# Altium schematic sheet leo_SBM_BUCK.SchDoc
size A; SheetNumber: 2; SheetTotal: 6
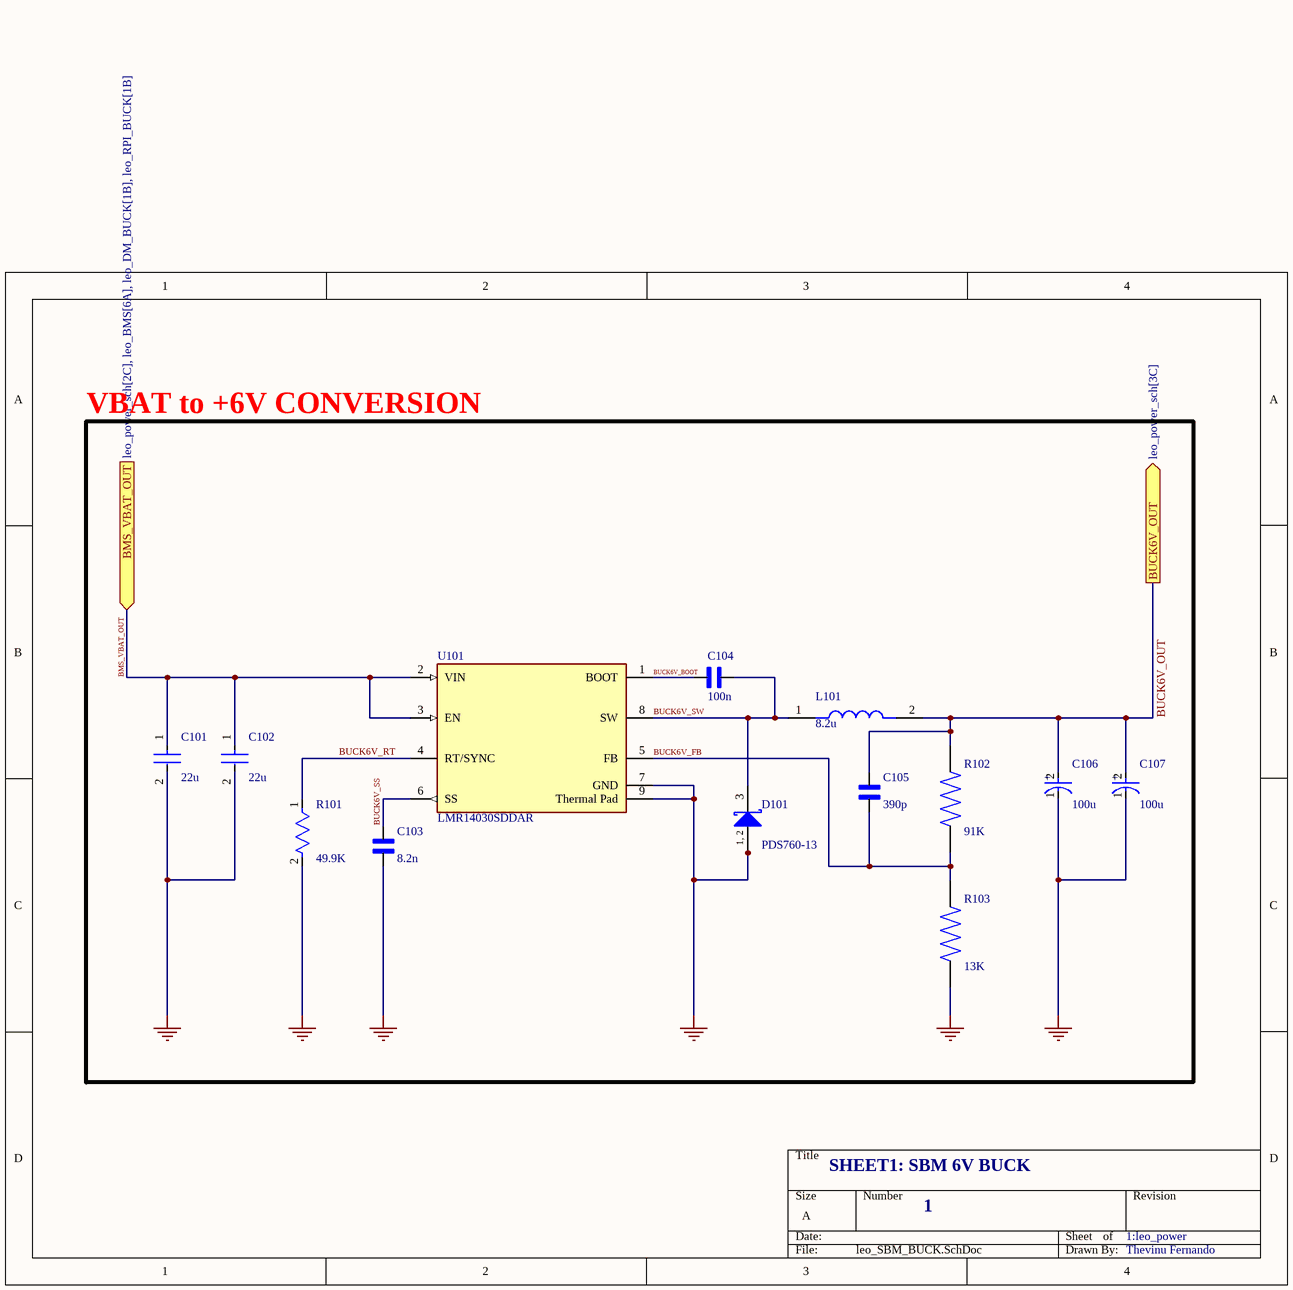
[diagram p0: leo_SBM_BUCK.SchDoc]

## Parts
C101  22u  [CAP_1206]
C102  22u  [CAP_1206]
C103  8.2n  [CAP_0402]
C104  100n  [CAP_0402]
C105  390p  [CAP_0402]
C106  100u  [FP-OS-CON-SMT-C6-MFG]
C107  100u  [FP-OS-CON-SMT-C6-MFG]
D101  PDS760-13  [DIOD-POWERDI5-3_V]
L101  8.2u  [IND_104CDMCCDS-8R2MC]
R101  49.9K  [RES_0805]
R102  91K  [RES_0603]
R103  13K  [RES_0603]
U101  LMR14030SDDAR  [FP-DDA0008E-MFG]

## Blocks framed on the sheet
VBAT to +6V CONVERSION: C101-C107 D101 L101 R101-R103 U101

## Ports
BMS_VBAT_OUT (in, see leo_power_sch[2C], leo_BMS[6A], leo_DM_BUCK[1B], leo_RPI_BUCK[1B]), BUCK6V_OUT (out, see leo_power_sch[3C])

## Nets
GND: C101.2 C102.2 C103.1 C106.1(C) C107.1(C) D101.1(A) D101.2(A) R101.2 R103.1 U101.7(GND) U101.9(Thermal_Pad)
BMS_VBAT_OUT: C101.1 C102.1 U101.2(VIN) U101.3(EN) ; port BMS_VBAT_OUT
BUCK6V_BOOT: C104.2 U101.1(BOOT)
BUCK6V_FB: C105.1 R102.1 R103.2 U101.5(FB)
BUCK6V_OUT: C105.2 C106.2(A) C107.2(A) L101.2 R102.2 ; port BUCK6V_OUT
BUCK6V_RT: R101.1 U101.4(RT/SYNC)
BUCK6V_SS: C103.2 U101.6(SS)
BUCK6V_SW: C104.1 D101.3(K) L101.1 U101.8(SW)

## Notes on the sheet
- SHEET1: SBM 6V BUCK
- 1
- 1:leo_power
- Thevinu Fernando
- (in symbol 16SVPC100M) +
- (in symbol PDS760-13) 1, 2

## Library data of the parts
C101 C102 = CAP_1206: Ceramic Capacitor, Multilayer, Ceramic, 25V, 10% +Tol, 10% -Tol, X5R, 15% TC, 22uF, Surface Mount, 1206; Part Number: CL31A226KAHNNNE; Manufacturer: Samsung; Symbol Hash: fb88589c83559698c54462c48d907c3ddae810bd717f4f20b193cecb944ab7ab; Verification Version: 0.0.0.3; Capacitance: 22µF; Mouser Part Number: 187-CL31A226KAHNNNE; Temperature Coefficient: 15%; Temperature Range High: +85°C; Digikey Description: CAP CER 22UF 25V X5R 1206; Digikey Part Number: 1276-3047-1-ND; Tolerance: 10%; ComponentLink2URL: https://product.samsungsem.com/mlcc/CL31A226KAHNNN.do; ComponentLink2Description: Datasheet; Voltage Rating: 25V; Lead Free: Yes; Height: 1.8mm; Temperature Characteristic: X5R; Automotive: No; Package: CL31H-0.2; Temperature Range Low: -55°C; Capacitance: 22uF; RoHS: TRUE; Material: Ceramic; Ipc Land Pattern Name: CAPC320160X160; ComponentLink1Description: Upverter; Supplier 2: Mouser; Supplier 1: Digi-Key; ComponentLink1URL: https://upverter.com/part/id/4e7a76ad8fe2f2e1/; Supplier Part Number 2: 187-CL31A226KAHNNNE; Supplier Part Number 1: 1276-3047-1-ND; Value: 22uF; helpURL: https://upverter.com/part/id/4e7a76ad8fe2f2e1/; Temperature: -55°C to +85°C; RoHS: Compliant; Dielectric: X5R; HelpURL: https://product.samsungsem.com/mlcc/CL31A226KAHNNN.do; Max Operating Temperature: 85°C; Voltage Rating (DC): 25V; ComponentLink2Description: Datasheet URL; Min Operating Temperature: -55°C; Case/Package: 1206
C103-C105 = CAP_0402: ±10% 50V Ceramic Capacitor X7R 0402; MF: Samsung; MP: CL05B104KO5NNNC; SnapEDA_Link: https://www.snapeda.com/parts/CL05B104KO5NNNC/Samsung/view-part/?ref=snap; Package: SMD-2-2 Samsung; Value: *; Check_prices: https://www.snapeda.com/parts/CL05B104KO5NNNC/Samsung/view-part/?ref=eda
C106 C107 = 16SVPC100M: 100uF ±20% 16V Aluminum - Polymer Capacitors SMD,D6.3xL5.9mm 2000hrs@105℃; Ripple Current: 2.49A; Leakage Current: 300uA; Life (Hours): 2000Hour; ESR (Equivalent Series Resistance): 24mR; Polarity: Polar; Dissipation Factor: 12%; Voltage Rating: 16V; Max Operating Temperature: 105°C; Number of Pins: 6; Case/Package: Radial; Length: 5.9mm; Termination: SMD/SMT; Voltage: 16V; Ripple Current (AC): 2.49A; Diameter: 6.3mm; Capacitance: 100uF; Min Operating Temperature: -55°C; Package Quantity: 1000; Series: OS-CON™, SVPC; Lead Free: Lead Free; Packaging: Tape and Reel; Height - Seated (Max): 0.236inch; REACH SVHC: No SVHC; Radiation Hardening: No; Tolerance: 20%; Mount: Surface Mount; Height: 5.9mm; RoHS Compliant: Yes; Construction: Cylindrical; Voltage Rating (DC): 16V
D101 = PDS760-13: Schottky Barrier Rectifier, 60 V, 7 A, -65 to 150 degC, 3-Pin SMD, RoHS, Tape and Reel; Manufacturer: Diodes Inc; Max Repetitive Reverse Voltage (Vrrm): 60V; Element Configuration: CommonAnode; Max Forward Surge Current (Ifsm): 275A; Polarity: Standard; Forward Voltage: 620mV; Forward Current: 7A; Peak Reverse Current: 200uA; Case\/Package: SMD/SMT; Manufacturer URL: http://www.diodes.com/; Reverse Voltage (DC): 60V; Lead Free: LeadFree; Voltage Rating (DC): 60V; Min Operating Temperature: -65degC; Package Description: 3-Pin Surface Mount Device, Body 3.975 x 5.375 mm, Pitch 1.84 mm; Length: 4.05mm; Datasheet URL: https://www.diodes.com/assets/Datasheets/ds30477.pdf; REACH SVHC: NoSVHC; Peak Non-Repetitive Surge Current: 275A; Output Current: 7A; Contact Plating: Matte; Mounting Technology: SurfaceMount; Mount: SurfaceMount; RoHSCompliant: true; Weight: 0.003386oz; Current Rating: 7A; Max Operating Temperature: 150degC; Package Quantity: 5000; Height: 1.15mm; Average Rectified Current: 7A; Datasheet Version: Rev. 13-2, 10/2012; Number of Pins: 5; Width: 5.45mm; Packaging: TapeandReel; Radiation Hardening: No; Package Reference: POWERDI5-3
L101 = 104CDMCCDS-8R2MC: Inductor Power Shielded/Molded Wirewound 8.2uH 20% 100KHz Metal 8.3A 0.027Ohm DCR 4040 T/R; MF: Sumida; Package: Nonstandard Sumida; Check_prices: https://www.snapeda.com/parts/104CDMCCDS-8R2MC/Sumida/view-part/?ref=eda; Value: *; Price: None; Purchase-URL: https://pricing.snapeda.com/search/part/104CDMCCDS-8R2MC/?ref=eda; MP: 104CDMCCDS-8R2MC; SnapEDA_Link: https://www.snapeda.com/parts/104CDMCCDS-8R2MC/Sumida/view-part/?ref=snap; Availability: In Stock
R101 = RES_0805: 49.9kΩ ±0.1% 125mW 0805 Thin Film Resistor AEC-Q200; Temperature Coefficient: 25ppm/°C; Voltage Rating (DC): 100V; Weight: 5.499807mg; Lead Free: Lead Free; Max Operating Temperature: 155°C; Number of Terminations: 2; Case Code (Metric): 2012; Power Rating: 125mW; Case/Package: 0805; Lifecycle Status: Production; Resistance: 49.9kΩ; Case Code (Imperial): 0805; Composition: Metal Film, Thin Film; RoHS: Compliant; Features: Automotive AEC-Q200; Radiation Hardening: No; Termination: SMD/SMT; Depth: 1.25mm; Mount: Surface Mount; Number of Pins: 2; Contact Plating: Tin; Min Operating Temperature: -55°C; REACH SVHC: Unknown; Tolerance: 0.1%; Length: 2mm; Height: 500µm; Schedule B: 8533210045, 8533210045|8533210045|8533210045|8533210045|8533210045|8533210045|8533210045|8533210045|8533210045|8533210045|8533210045|8533210045|8533210045|8533210045|8533210045|8533210045, 8533210045|8533210045|8533210045|8533210045|8533210045|8533210045|8533210045|8533210045|8533210045|8533210045|8533210045|8533210045|8533210045|8533210045|8533210045|8533210045|8533210045, 8533210045|8533210045|8533210045|8533210045|8533210045|8533210045|8533210045|8533210045|8533210045|8533210045|8533210045|8533210045|8533210045|8533210045|8533210045|8533210045|8533210045|8533210045; Military Standard: Not; Max Power Dissipation: 125mW; Packaging: Cut Tape; Voltage Rating: 100V
R102 R103 = RES_0603: Â±1% 0.1W, 1/10W Chip Resistor 0603 (1608 Metric) Moisture Resistant Thick Film; MF: Yageo; MP: RC0603FR-0791KL; SnapEDA_Link: https://www.snapeda.com/parts/RC0603FR-0791KL/Yageo/view-part/?ref=snap; Package: 1608 Yageo; Value: *; Check_prices: https://www.snapeda.com/parts/RC0603FR-0791KL/Yageo/view-part/?ref=eda
U101 = LMR14030SDDAR: IC REG BUCK ADJ 3.5A 8SOPWR; Manufacturer: Texas Instruments; Output Voltage: 0.8-28V; Switching Frequency: 200-2500kHz; Max Duty Cycle: 97%; Max Junction Temp: +125°C; Number Of Outputs: 1; Max Supply Voltage: 40V; Nominal Supply Current: 40uA; Min Supply Voltage: 4V; Output Type: AdjustableProgrammable; Standoff Height: 0mm; Ipc Land Pattern Name: SOIC127P600X170-8; ComponentLink2Description: Datasheet; Digikey Description: IC REG BUCK ADJ 3.5A 8SOPWR; Device Class L1: Integrated Circuits (ICs); ComponentLink2URL: http://www.ti.com/lit/ds/symlink/lmr14030.pdf; Temperature Range High: +125°C; Temperature: -40°C to +125°C; Output Current: 3.5A; Octopart: https://octopart.com/lmr14030sddar-texas+instruments-55347267; Device Class L3: Voltage Regulators - Switching; Lead Free: Yes; Mouser Description: 40V, 3.5A SIMPLE SWITCHER, 2.2MHz Step-Down Regulator with 40uA IQ 8-SO PowerPAD -40 to 125; Temperature Range Low: -40°C; Automotive: No; Switching Topology: Buck; Category: IC; RoHS: TRUE; Manufacturer Part Number: LMR14030SDDAR; Height: 1.7mm; Device Class L2: Power Management ICs; Package: DDA0008E